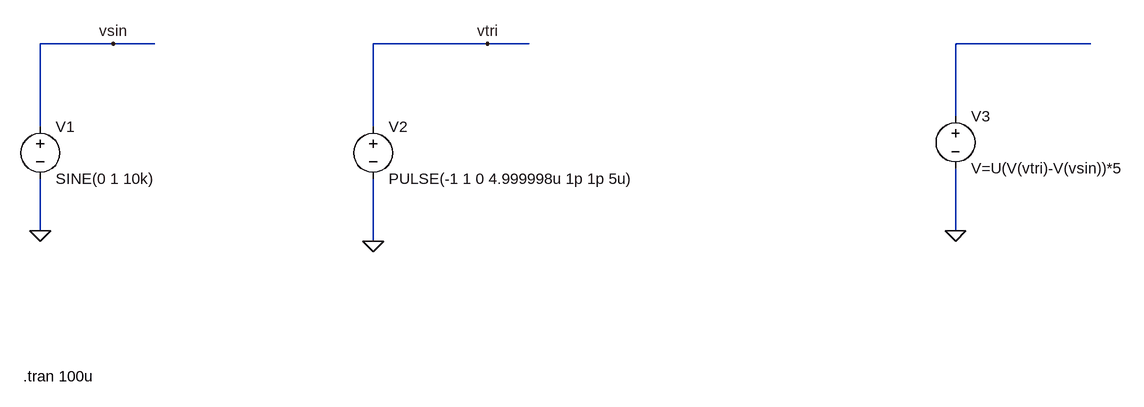
[diagram p0: schematic PWMGenerator.asc]
PWMGenerator.asc, the LTspice schematic file:
Version 4
SHEET 1 1324 680
WIRE -608 -720 -720 -720
WIRE -544 -720 -608 -720
WIRE -32 -720 -208 -720
WIRE 32 -720 -32 -720
WIRE 896 -720 688 -720
WIRE 688 -608 688 -720
WIRE -720 -592 -720 -720
WIRE -208 -592 -208 -720
WIRE -720 -432 -720 -512
WIRE 688 -432 688 -528
WIRE -208 -416 -208 -512
FLAG -720 -432 0
FLAG -208 -416 0
FLAG -608 -720 vsin
FLAG -32 -720 vtri
FLAG 688 -432 0
SYMBOL voltage -720 -608 R0
WINDOW 123 0 0 Left 0
WINDOW 39 0 0 Left 0
SYMATTR InstName V1
SYMATTR Value SINE(0 1 10k)
SYMBOL voltage -208 -608 R0
WINDOW 123 0 0 Left 0
WINDOW 39 0 0 Left 0
SYMATTR InstName V2
SYMATTR Value PULSE(-1 1 0 4.999998u 1p 1p 5u)
SYMBOL voltage 688 -624 R0
SYMATTR InstName V3
SYMATTR Value V=U(V(vtri)-V(vsin))*5
SYMATTR Prefix B
TEXT -746 -208 Left 2 !.tran 100u

The netlist it stands for:
* PWMGenerator.asc
V1 vsin 0 SINE(0 1 10k)
V2 vtri 0 PULSE(-1 1 0 4.999998u 1p 1p 5u)
B§V3 N001 0 V=U(V(vtri)-V(vsin))*5
.tran 100u
.backanno
.end